# Altium schematic sheet STM32.SchDoc
size A4; SheetNumber: 1; SheetTotal: 1
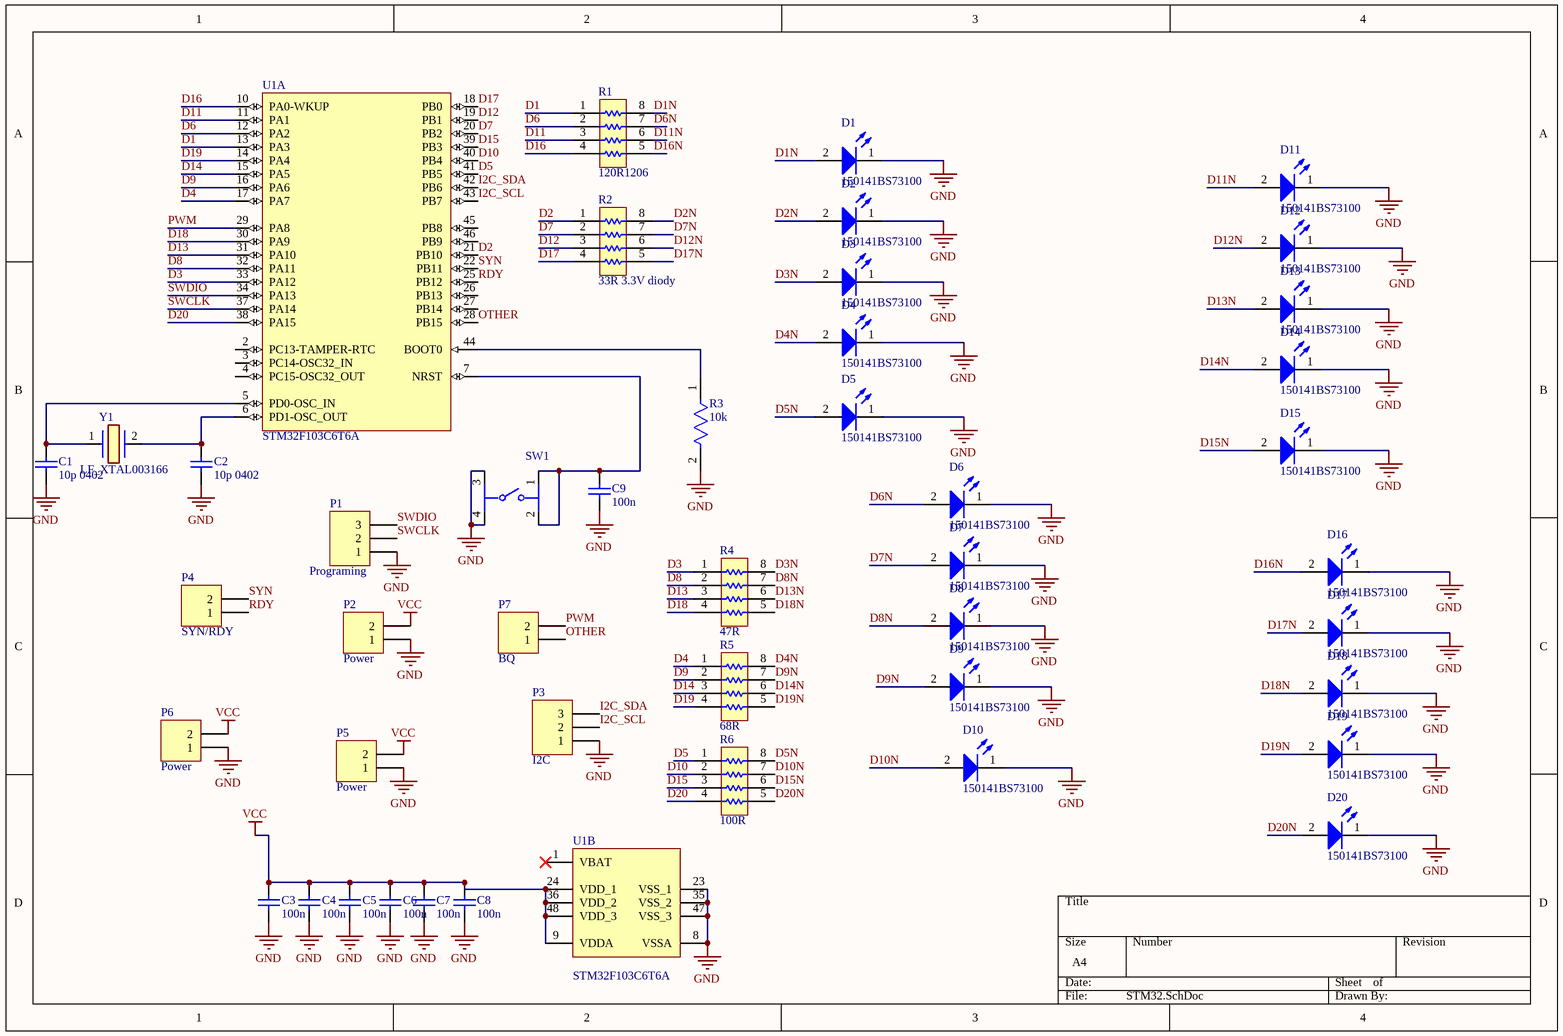
[diagram p0: STM32.SchDoc]

## Parts
C1  10p 0402  [CAPC1006X50X20ML10T10]
C2  10p 0402  [CAPC1006X50X20ML10T10]
C3  100n  [1608[0603]]
C4  100n  [1608[0603]]
C5  100n  [1608[0603]]
C6  100n  [1608[0603]]
C7  100n  [1608[0603]]
C8  100n  [1608[0603]]
C9  100n  [1608[0603]]
D1  150141BS73100  [WL-SMTW_3528]
D2  150141BS73100  [WL-SMTW_3528]
D3  150141BS73100  [WL-SMTW_3528]
D4  150141BS73100  [WL-SMTW_3528]
D5  150141BS73100  [WL-SMTW_3528]
D6  150141BS73100  [WL-SMTW_3528]
D7  150141BS73100  [WL-SMTW_3528]
D8  150141BS73100  [WL-SMTW_3528]
D9  150141BS73100  [WL-SMTW_3528]
D10  150141BS73100  [WL-SMTW_3528]
D11  150141BS73100  [WL-SMTW_3528]
D12  150141BS73100  [WL-SMTW_3528]
D13  150141BS73100  [WL-SMTW_3528]
D14  150141BS73100  [WL-SMTW_3528]
D15  150141BS73100  [WL-SMTW_3528]
D16  150141BS73100  [WL-SMTW_3528]
D17  150141BS73100  [WL-SMTW_3528]
D18  150141BS73100  [WL-SMTW_3528]
D19  150141BS73100  [WL-SMTW_3528]
D20  150141BS73100  [WL-SMTW_3528]
P1  Programing  [HDR1X3]
P2  Power  [HDR1X2]
P3  I2C  [HDR1X3]
P4  SYN/RDY  [HDR1X2]
P5  Power  [HDR1X2]
P6  Power  [HDR1X2]
P7  BQ  [HDR1X2]
R1  120R1206  [BOUR-CAY16-J4_V]
R2  33R 3.3V diody  [BOUR-CAY16-J4_V]
R3  10k  [FP-CRCW0603-e3-MFG]
R4  47R  [BOUR-CAY16-J4_V]
R5  68R  [BOUR-CAY16-J4_V]
R6  100R  [BOUR-CAY16-J4_V]
SW1  PTS645SM43SMTR92LFS  [FP-PTS645SM43SMTR92LFS-MFG]  (value not drawn)
U1  STM32F103C6T6A  [STM-LQFP48_L]  (parts A,B of 2)
Y1  LF_XTAL003166  [LFXTAL003166]

## Nets
GND: C1.1 C2.1 C3.1 C4.1 C5.1 C6.1 C7.1 C8.1 C9.1 D1.1(K) D2.1(K) D3.1(K) D4.1(K) D5.1(K) D6.1(K) D7.1(K) D8.1(K) D9.1(K) D10.1(K) D11.1(K) D12.1(K) D13.1(K) D14.1(K) D15.1(K) D16.1(K) D17.1(K) D18.1(K) D19.1(K) D20.1(K) P1.1 P2.1 P3.1 P5.1 P6.1 R3.2 SW1.3 SW1.4 U1.8(VSSA) U1.23(VSS_1) U1.35(VSS_2) U1.47(VSS_3)
VCC: C3.2 C4.2 C5.2 C6.2 C7.2 C8.2 P2.2 P5.2 P6.2 U1.9(VDDA) U1.24(VDD_1) U1.36(VDD_2) U1.48(VDD_3)
D1: R1.1 U1.13(PA3)
D1N: D1.2(A) R1.8
D2: R2.1 U1.21(PB10)
D2N: D2.2(A) R2.8
D3: R4.1 U1.33(PA12)
D3N: D3.2(A) R4.8
D4: R5.1 U1.17(PA7)
D4N: D4.2(A) R5.8
D5: R6.1 U1.41(PB5)
D5N: D5.2(A) R6.8
D6: R1.2 U1.12(PA2)
D6N: D6.2(A) R1.7
D7: R2.2 U1.20(PB2)
D7N: D7.2(A) R2.7
D8: R4.2 U1.32(PA11)
D8N: D8.2(A) R4.7
D9: R5.2 U1.16(PA6)
D9N: D9.2(A) R5.7
D10: R6.2 U1.40(PB4)
D10N: D10.2(A) R6.7
D11: R1.3 U1.11(PA1)
D11N: D11.2(A) R1.6
D12: R2.3 U1.19(PB1)
D12N: D12.2(A) R2.6
D13: R4.3 U1.31(PA10)
D13N: D13.2(A) R4.6
D14: R5.3 U1.15(PA5)
D14N: D14.2(A) R5.6
D15: R6.3 U1.39(PB3)
D15N: D15.2(A) R6.6
D16: R1.4 U1.10(PA0-WKUP)
D16N: D16.2(A) R1.5
D17: R2.4 U1.18(PB0)
D17N: D17.2(A) R2.5
D18: R4.4 U1.30(PA9)
D18N: D18.2(A) R4.5
D19: R5.4 U1.14(PA4)
D19N: D19.2(A) R5.5
D20: R6.4 U1.38(PA15)
D20N: D20.2(A) R6.5
I2C_SCL: P3.2 U1.43(PB7)
I2C_SDA: P3.3 U1.42(PB6)
OTHER: P7.1 U1.28(PB15)
PWM: P7.2 U1.29(PA8)
RDY: P4.1 U1.25(PB12)
SWCLK: P1.2 U1.37(PA14)
SWDIO: P1.3 U1.34(PA13)
SYN: P4.2 U1.22(PB11)
NetC1_2: C1.2 U1.5(PD0-OSC_IN) Y1.1
NetC2_2: C2.2 U1.6(PD1-OSC_OUT) Y1.2
NetC9_2: C9.2 SW1.1 SW1.2 U1.7(NRST)
NetR3_1: R3.1 U1.44(BOOT0)

Not connected (* = marked no-connect by the designer): U1 1(VBAT)* 2(PC13-TAMPER-RTC) 3(PC14-OSC32_IN) 4(PC15-OSC32_OUT) 26(PB13) 27(PB14) 45(PB8) 46(PB9)

## Library data of the parts
C1 C2 = CMP-2008-04829-1: Manufacturer: AVX Interconnect / Elco; Part Number: 0402YJ100FBSTR
C3-C9 = Cap Semi: Capacitor (Semiconductor SIM Model); Published: 8-Jun-2000; LatestRevisionDate: 29-May-2009; LatestRevisionNote: IPC-7351 Footprint Added.; PackageReference: C1206; Publisher: Altium Limited; PackageDescription: Chip Capacitor
D1-D20 = CMP-1429-00005-2: NexarPartId: 29717793; Dominant Wavelength: 470nm; Luminous Intensity: 270mcd; Test Current: 20mA; Color: Blue; Peak Wavelength: 465nm; Forward Voltage: 3.2V; Forward Current: 100mA; Lens Style: Clear, Round; Viewing Angle: 120°; Max Reverse Voltage (DC): 5V; Length: 3.5mm; RoHS: Compliant; Packaging: Tape and Reel; REACH SVHC: Unknown; Max Operating Temperature: 85°C; Case Code (Metric): 3528; Wavelength: 470nm; Case Code (Imperial): 1411; Mount: Surface Mount; Width: 2.8mm; Case/Package: 3528; Height: 1.9mm; Min Operating Temperature: -40°C
P1 P3 = Header 3: Header, 3-Pin; LatestRevisionDate: 17-Jul-2002; LatestRevisionNote: Re-released for DXP Platform.; Publisher: Altium Limited
P2 P4-P7 = Header 2: Header, 2-Pin; LatestRevisionDate: 17-Jul-2002; LatestRevisionNote: Re-released for DXP Platform.; Publisher: Altium Limited
R1 R2 R4-R6 = CMP-1747-00007-1: Chip Resistor Array, 1 KOhm, +/- 5%, 62.5 mW, -55 to 125 degC, 8-Pin SMD, RoHS, Tape and Reel; Power Rating: 100 mW; Tolerance: 1%; Voltage Rating (DC): 50 V; Resistance: 330 Ohm; Case\Package: 0603; RoHSCompliant: true; Case Code (Metric): 1608; Pins: 2; PackageDescription: 8-Pin Surface Mount Device, Body 1.6 x 3.2 mm, Pitch 0.8 mm; Height: 0.45 mm; Min Operating Temperature: -55 degC; ComponentLink1URL: http://www.bourns.com/; Case Code (Imperial): 0603; Packaging: Tape and Reel; PackageReference: CAY16-J4; ComponentLink1Description: Manufacturer URL; ComponentLink2Description: Datasheet; Length: 1.6 mm; Width: 0.8 mm; Max Operating Temperature: 155 degC; Mount: Surface Mount; DatasheetVersion: Sep-14; Voltage Rating: 50 V; REACH SVHC: No SVHC; ComponentLink2URL: http://www.bourns.com/pdfs/CATCAY.pdf; Package Quantity: 5000
R3 = CMP-2000-03525-2: RES Thick Film, 10kΩ, 1%, 0.1W, 100ppm/°C, 0603; Max Power Dissipation: 100mW; Working Voltage: 75V; Resistance: 66.5kR; Composition: Thick Film; Radiation Hardening: No; Length: 1.55mm; Package Quantity: 10; Min Operating Temperature: -55°C; Features: Automotive AEC-Q200; Number of Pins: 2; Weight: 7.1E-05oz; Case/Package: 0603; Case Code (Imperial): 0603; Military Standard: Not; Height: 0.45mm; Tolerance: 1%; Power Rating: 100mW; Voltage Rating: 75V; Case Code (Metric): 1608; Number of Terminations: 2; Width: 0.85mm; Packaging: Tape and Reel; Contact Plating: Tin; Termination: SMD/SMT; Max Operating Temperature: 155°C; Depth: 0.85mm; Temperature Coefficient: 100ppm/°C
SW1 = CMP-2000-05160-2: SWITCH TACTILE SPST-NO 0.05A 12V; Contact Resistance: 100mR; Throw Configuration: SPST; Illumination Type: Non-Illuminated; Mechanical Life: 100000Cycles; Current Rating: 50mA; Switch Function: Off-Mom; Actuator Length: 0.85mm; Actuator Material: Nylon; Actuator Type: Standard; Operating Force: 160gf; Min Operating Temperature: -20°C; REACH SVHC: No SVHC; Termination: Gull Wing; Case/Package: SMD/SMT; Packaging: Tape and Reel; Mount: Surface Mount; Voltage Rating (DC): 12V; Orientation: Straight; Lead Free: Lead Free; Contact Material: Silver; Color: Black; Max Current Rating: 50mA; Contact Plating: Silver; Depth: 9mm; Package Quantity: 1; Max Voltage Rating (DC): 12V; Length: 6mm; Max Operating Temperature: 60°C
U1 = CMP-0237-00254-3: ARM Cortex-M3 32-bit MCU, 32 KB Flash, 10 KB Internal RAM, 37 I/Os, 48-pin LQFP, -40 to 85 degC, Tray; Operating Frequency(F) (Processor speed) (MHz): 72; A/D Converter: 2x12-bit (10 Channel); Supply Voltage(Vcc) min (V): 2; FLASH Size (Prog) (kB): 32; I/Os (High Current): 37; Internal RAM Size (kB): 10; PackageVersion: Rev. 6, 06/2013; ComponentLink3Description: Package Specification; ComponentLink2URL: http://www.st.com/st-web-ui/static/active/en/resource/technical/document/datasheet/CD00210843.pdf; ComponentLink1URL: http://www.st.com/web/en/home.html; PackageDescription: 48-Pin Low Profile Quad Flat Package, 7 x 7 mm Body, 0.5 mm Pitch; PartNumber: STM32F103C6T6A; ComponentLink3URL: http://www.st.com/st-web-ui/static/active/en/resource/technical/document/datasheet/DM00058181.pdf; PackageReference: LQFP48; Packing: Tray; ComponentLink2Description: Datasheet; Mounting Technology: Surface Mount; ComponentLink1Description: Manufacturer URL; Core: ARM Cortex-M3; DatasheetVersion: Rev. 6
Y1 = LF_XTAL003166: Crystal or Oscillator; Manufacturer_Name: IQD; Manufacturer_Part_Number: LF XTAL003166; Datasheet Link: https://www.tme.eu/Document/8dce48f98215dcf997cc1ef25822beeb/LFXTAL003166.pdf; Height: 4.3mm